# Altium schematic sheet Connectors.SchDoc
size A4; SheetNumber: 4; SheetTotal: 4
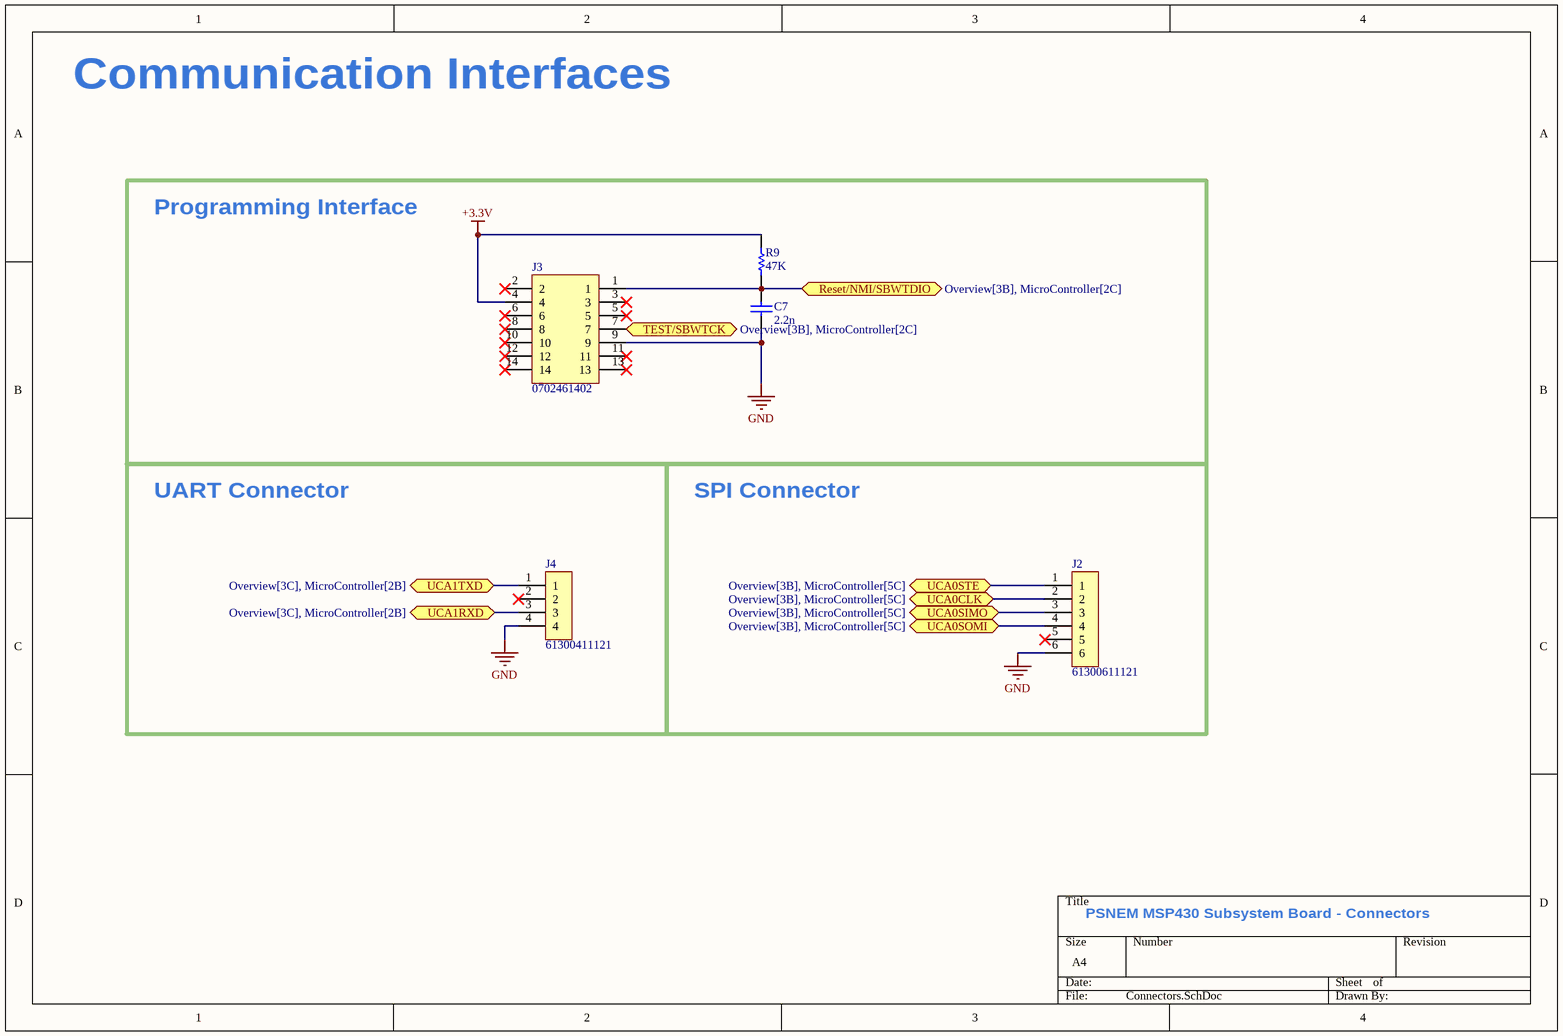
[diagram p0: Connectors.SchDoc]

## Parts
C7  2.2n  [0805 Cap]
J2  61300611121  [61300611121]
J3  0702461402  [0702461402]
J4  61300411121  [61300411121]
R9  47K  [RESC1608X06N]

## Blocks framed on the sheet
Programming Interface: C7 J3 R9
UART Connector: J4
SPI Connector: J2

## Ports
Reset/NMI/SBWTDIO (bidir, see Overview[3B], MicroController[2C]), TEST/SBWTCK (bidir, see Overview[3B], MicroController[2C]), UCA0CLK (bidir, see Overview[3B], MicroController[5C]), UCA0SIMO (bidir, see Overview[3B], MicroController[5C]), UCA0SOMI (bidir, see Overview[3B], MicroController[5C]), UCA0STE (bidir, see Overview[3B], MicroController[5C]), UCA1RXD (bidir, see Overview[3C], MicroController[2B]), UCA1TXD (bidir, see Overview[3C], MicroController[2B])

## Nets
+3.3V: J3.4 R9.2
GND: C7.1 J2.6 J3.9 J4.4
Reset/NMI/SBWTDIO: C7.2 J3.1 R9.1 ; port Reset/NMI/SBWTDIO
TEST/SBWTCK: J3.7 ; port TEST/SBWTCK
UCA0CLK: J2.2 ; port UCA0CLK
UCA0SIMO: J2.3 ; port UCA0SIMO
UCA0SOMI: J2.4 ; port UCA0SOMI
UCA0STE: J2.1 ; port UCA0STE
UCA1RXD: J4.3 ; port UCA1RXD
UCA1TXD: J4.1 ; port UCA1TXD

Not connected (* = marked no-connect by the designer): J2 5*; J3 2* 3* 5* 6* 8* 10* 11* 12* 13* 14*; J4 2*

## Notes on the sheet
- Communication Interfaces
- PSNEM MSP430 Subsystem Board - Connectors

## Library data of the parts
C7 = CC0805KRX7R9BB222: 2200 pF ±10% 50V Ceramic Capacitor X7R 0805 (2012 Metric); value: 2.2n
J2 = 61300611121: CONN HEADER VERT 6POS 2.54MM
J3 = 0702461402: Connector Header Through Hole 14 position 0.100" (2.54mm)
J4 = 61300411121: Connector Header Through Hole 4 position 0.100" (2.54mm)
R9 = ERA-3VEB4702V: Thin Film Resistors - SMD 0603 0.1% 47Kohm 25ppm SMD; value: 47K